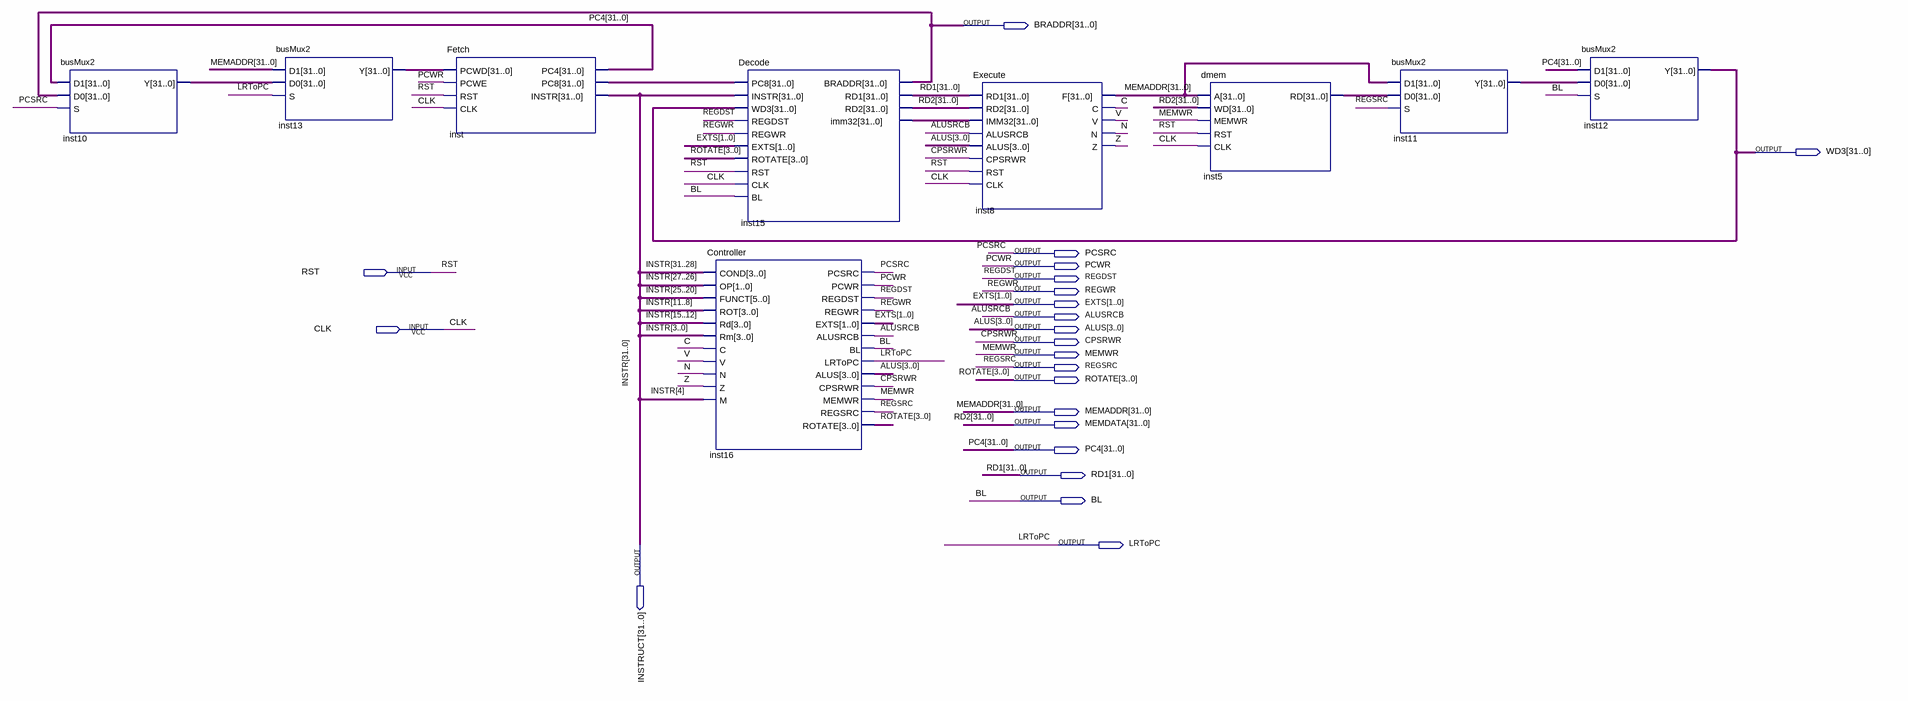
[diagram p0: schematic sheet]
// Quartus schematic ASCP.bdf as structural Verilog: 9 symbols, 22 pins
module ASCP (
  input  RST,
  input  CLK,
  output [31:0] BRADDR,
  output [31:0] WD3,
  output PCSRC,
  output PCWR,
  output REGDST,
  output REGWR,
  output [1:0] EXTS,
  output ALUSRCB,
  output [3:0] ALUS,
  output CPSRWR,
  output MEMWR,
  output REGSRC,
  output [3:0] ROTATE,
  output [31:0] MEMADDR,
  output [31:0] MEMDATA,
  output [31:0] PC4,
  output [31:0] RD1,
  output BL,
  output [31:0] INSTRUCT,
  output LRToPC
);

  wire C, N, V, Z;
  wire [31:0] inst5_rd, inst10_y, inst11_y, inst13_y, inst15_imm32, inst_pc8;

  busMux2 inst10 (.D1(PC4), .D0(BRADDR), .S(PCSRC), .Y(inst10_y));
  busMux2 inst13 (.D1(MEMADDR), .D0(inst10_y), .S(LRToPC), .Y(inst13_y));
  Fetch inst (.PCWD(inst13_y), .PCWE(PCWR), .RST(RST), .CLK(CLK), .PC4(PC4), .PC8(inst_pc8), .INSTR(INSTRUCT));
  Decode inst15 (
    .PC8(inst_pc8), .INSTR(INSTRUCT), .WD3(WD3), .REGDST(REGDST), .REGWR(REGWR), .EXTS(EXTS),
    .ROTATE(ROTATE), .RST(RST), .CLK(CLK), .BL(BL), .BRADDR(BRADDR), .RD1(RD1), .RD2(MEMDATA),
    .imm32(inst15_imm32));
  Controller inst16 (
    .COND(INSTRUCT[31:28]), .OP(INSTRUCT[27:26]), .FUNCT(INSTRUCT[25:20]), .ROT(INSTRUCT[11:8]),
    .Rd(INSTRUCT[15:12]), .Rm(INSTRUCT[3:0]), .C(C), .V(V), .N(N), .Z(Z), .M(INSTRUCT[4]), .PCSRC(PCSRC),
    .PCWR(PCWR), .REGDST(REGDST), .REGWR(REGWR), .EXTS(EXTS), .ALUSRCB(ALUSRCB), .BL(BL), .LRToPC(LRToPC),
    .ALUS(ALUS), .CPSRWR(CPSRWR), .MEMWR(MEMWR), .REGSRC(REGSRC), .ROTATE(ROTATE));
  Execute inst8 (
    .RD1(RD1), .RD2(MEMDATA), .IMM32(inst15_imm32), .ALUSRCB(ALUSRCB), .ALUS(ALUS), .CPSRWR(CPSRWR),
    .RST(RST), .CLK(CLK), .F(MEMADDR), .C(C), .V(V), .N(N), .Z(Z));
  dmem inst5 (.A(MEMADDR), .WD(MEMDATA), .MEMWR(MEMWR), .RST(RST), .CLK(CLK), .RD(inst5_rd));
  busMux2 inst11 (.D1(MEMADDR), .D0(inst5_rd), .S(REGSRC), .Y(inst11_y));
  busMux2 inst12 (.D1(PC4), .D0(inst11_y), .S(BL), .Y(WD3));

  // Other names for the same wires on the sheet: INSTR[31:0] = INSTRUCT; RD2[31:0] = MEMDATA
endmodule
